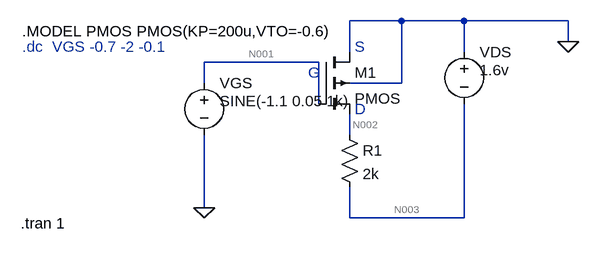
[diagram p0: schematic pmos_vgs_-1.1_0.05_1k_vth_-0.6_vds_1.6_cs_amplifier.asc]
pmos_vgs_-1.1_0.05_1k_vth_-0.6_vds_1.6_cs_amplifier.asc, the LTspice schematic file:
Version 4
SHEET 1 880 680
WIRE 256 -16 176 -16
WIRE 352 -16 256 -16
WIRE 512 -16 352 -16
WIRE 512 16 512 -16
WIRE 176 32 176 -16
WIRE 352 32 352 -16
WIRE 128 48 -48 48
WIRE -48 80 -48 48
WIRE 256 80 256 -16
WIRE 256 80 176 80
WIRE 128 112 128 48
WIRE 176 160 176 128
WIRE -48 272 -48 160
WIRE 176 288 176 240
WIRE 352 288 352 112
WIRE 352 288 176 288
FLAG -48 272 0
FLAG 512 16 0
SYMBOL voltage 352 16 R0
WINDOW 123 0 0 Left 0
WINDOW 39 0 0 Left 0
WINDOW 3 24 44 Left 2
SYMATTR InstName VDS
SYMATTR Value 1.6v
SYMBOL voltage -48 64 R0
WINDOW 123 0 0 Left 0
WINDOW 39 0 0 Left 0
WINDOW 3 24 44 Left 2
SYMATTR InstName VGS
SYMATTR Value SINE(-1.1 0.05 1k)
SYMBOL res 160 144 R0
SYMATTR InstName R1
SYMATTR Value 2k
SYMBOL pmos4 128 32 R0
SYMATTR InstName M1
SYMATTR Value2 l=1u w=10u
TEXT 184 120 Left 2 ;D
TEXT 112 64 Left 2 ;G
TEXT 184 24 Left 2 ;S
TEXT -328 0 Left 2 !.MODEL PMOS PMOS(KP=200u,VTO=-0.6)
TEXT -328 24 Left 2 ;.dc  VGS -0.7 -2 -0.1
TEXT -330 296 Left 2 !.tran 1

The netlist it stands for:
* pmos_vgs_-1.1_0.05_1k_vth_-0.6_vds_1.6_cs_amplifier.asc
VDS 0 N003 1.6v
VGS N001 0 SINE(-1.1 0.05 1k)
R1 N002 N003 2k
M1 0 N001 N002 0 PMOS l=1u w=10u
.model NMOS NMOS
.model PMOS PMOS
.lib standard.mos
* D
* G
* S
.MODEL PMOS PMOS(KP=200u,VTO=-0.6)
* .dc  VGS -0.7 -2 -0.1
.tran 1
.backanno
.end

* Results of the author's LTspice run, read from the files saved beside the schematic
* Operating Point, zero values left out:
*   V(n003) = -1.6 V
*   V(n001) = -1.1 V
*   V(n002) = -1.1 V
*   Id(M1) = 250 µA
*   Ib(M1) = 1.11 pA
*   Is(M1) = -250 µA
*   I(R1) = 250 µA
*   I(Vds) = -250 µA
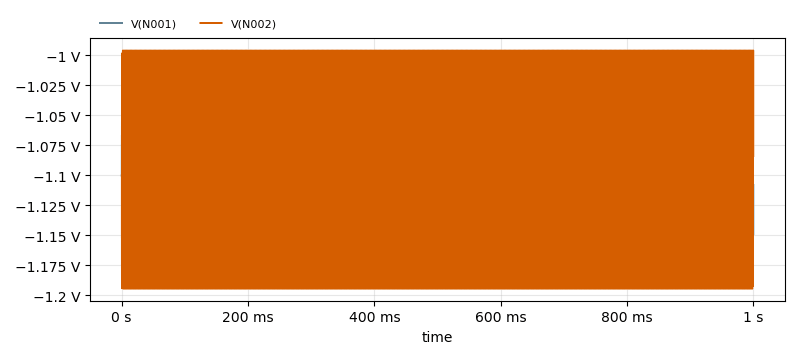
[diagram p1: Transient Analysis of pmos_vgs_-1.1_0.05_1k_vth_-0.6_vds_1.6_cs_amplifier.asc, plotted from the saved traces]
* Transient Analysis, 1 run:
*   V(N001): min -1.15 V, max -1.05 V, average -1.1 V, rms 1.1 V, last -1.1 V
*   V(N002): min -1.195 V, max -995.8 mV, average -1.097 V, rms 1.1 V, last -1.1 V